# EAGLE schematic Escon (EAGLE 7.1.0)
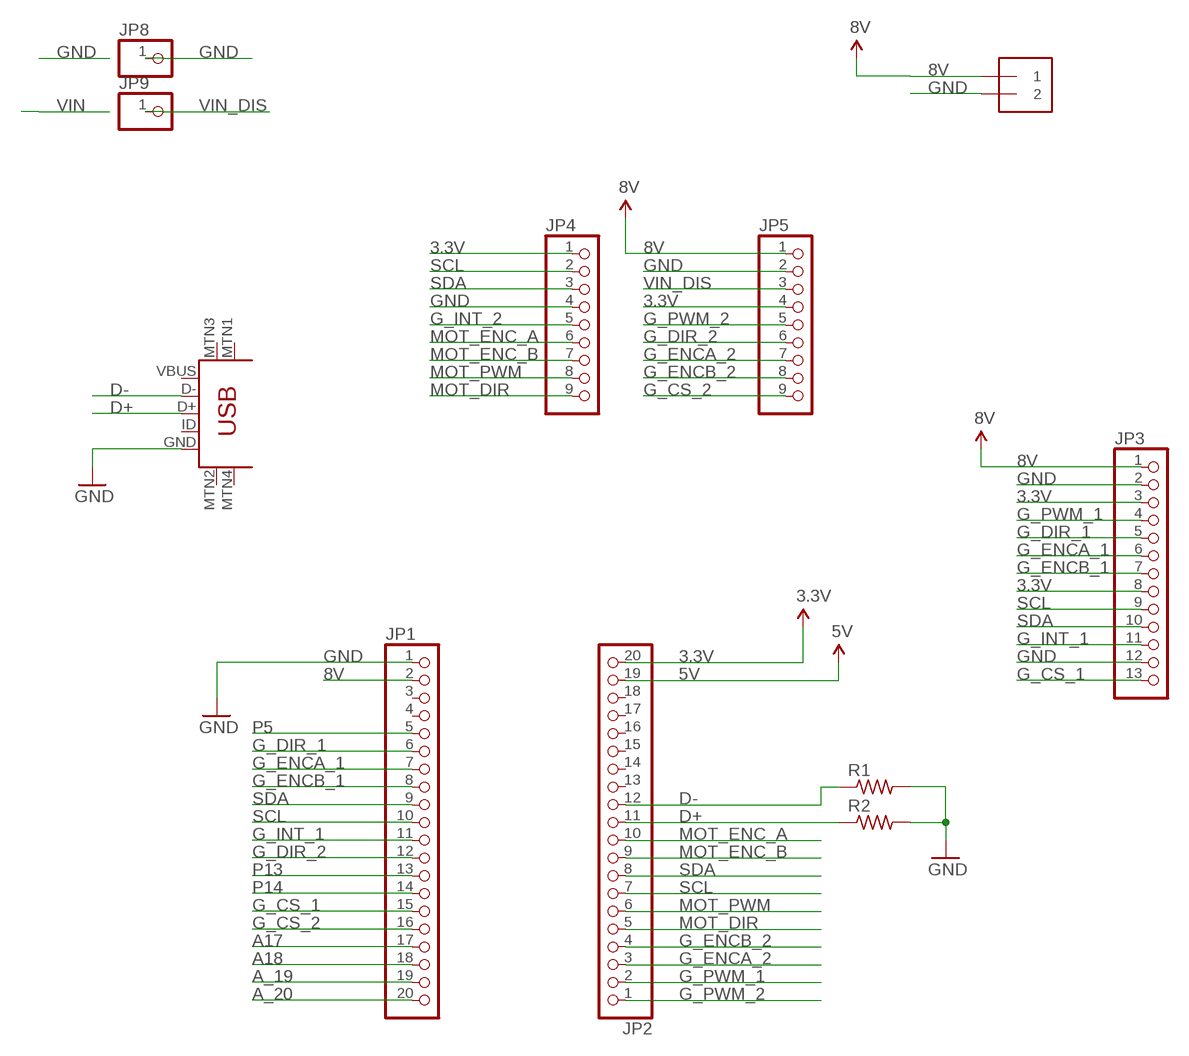
[diagram p0: schematic, sheet 1]

## Parts
J1  1X2-3.5MM  [1X2-3.5MM]
JP1  PINHD-1X20  [1X20]
JP2  PINHD-1X20  [1X20]
JP3  PINHD-1X13  [1X13]
JP4  PINHD-1X9  [1X09-BIG]
JP5  PINHD-1X9  [1X09-BIG]
JP8  PINHD-1X1  [1X01]
JP9  PINHD-1X1  [1X01]
R1  RES-US1206  [R1206]
R2  RES-US1206  [R1206]
U$1  USB-MINIB-5PIN  [USB-MINIB]

## Nets
3.3V: JP2.20 JP3.3 JP3.8 JP4.1 JP5.4
5V: JP2.19
8V: J1.1 JP1.2 JP3.1 JP5.1
A17: JP1.17
A18: JP1.18
A_19: JP1.19
A_20: JP1.20
D+: JP2.11 R2.1 U$1.D+
D-: JP2.12 R1.1 U$1.D-
G_CS_1: JP1.15 JP3.13
G_CS_2: JP1.16 JP5.9
G_DIR_1: JP1.6 JP3.5
G_DIR_2: JP1.12 JP5.6
G_ENCA_1: JP1.7 JP3.6
G_ENCA_2: JP2.3 JP5.7
G_ENCB_1: JP1.8 JP3.7
G_ENCB_2: JP2.4 JP5.8
G_INT_1: JP1.11 JP3.11
G_INT_2: JP4.5
G_PWM_1: JP2.2 JP3.4
G_PWM_2: JP2.1 JP5.5
GND: J1.2 JP1.1 JP3.2 JP3.12 JP4.4 JP5.2 JP8.1 R1.2 R2.2 U$1.GND
MOT_DIR: JP2.5 JP4.9
MOT_ENC_A: JP2.10 JP4.6
MOT_ENC_B: JP2.9 JP4.7
MOT_PWM: JP2.6 JP4.8
P5: JP1.5
P13: JP1.13
P14: JP1.14
SCL: JP1.10 JP2.7 JP3.9 JP4.2
SDA: JP1.9 JP2.8 JP3.10 JP4.3
VIN_DIS: JP5.3 JP9.1
Unconnected: JP1.3 JP1.4 JP2.13 JP2.14 JP2.15 JP2.16 JP2.17 JP2.18 U$1.ID U$1.MTN1(MTN2) U$1.MTN2(MTN3) U$1.MTN3(MTN1) U$1.MTN4 U$1.VBUS

## Library data of the parts
J1 = adafruit:1X2: 3.5mm Terminal block http://www.ladyada.net/library/pcb/eaglelibrary.html
JP1 JP2 = adafruit:PINHD-1X20: PIN HEADER
JP3 = adafruit:PINHD-1X13: PIN HEADER
JP4 JP5 = adafruit:PINHD-1X9: Pin header 1x10 0.1" spacing With round pins
JP8 JP9 = adafruit:PINHD-1X1: Pin header 1x1 for 0.1" spacing With round pins
R1 R2 = fab:RES-US: Resistor (US Symbol) Variants with postfix FAB are widened to allow the routing of internal traces
U$1 = SparkFun:USB-MINIB: Mini-USB "B" connector with 5th pin broken out. Created new symbol breaking out 5th "ID" pin in mini/micro USB connector spec. See: http://en.wikipedia.org/wiki/Mini_usb#Cables. Uses same footprint as 4-pin symbol. Also added pins to connect to mounting / shield pads if required (probably not generally needed as signals aren't shielded once they leave the connector).